# Altium schematic sheet LVDS_CSI.SchDoc
size 420 x 297 mm; Scale: 1:1; DocumentType: Схема электрическая принципиальная; SheetNumber: 19; SheetTotal: 23; DocumentTypeShort: Э3; DocumentInvertoryNumber: ㅤ
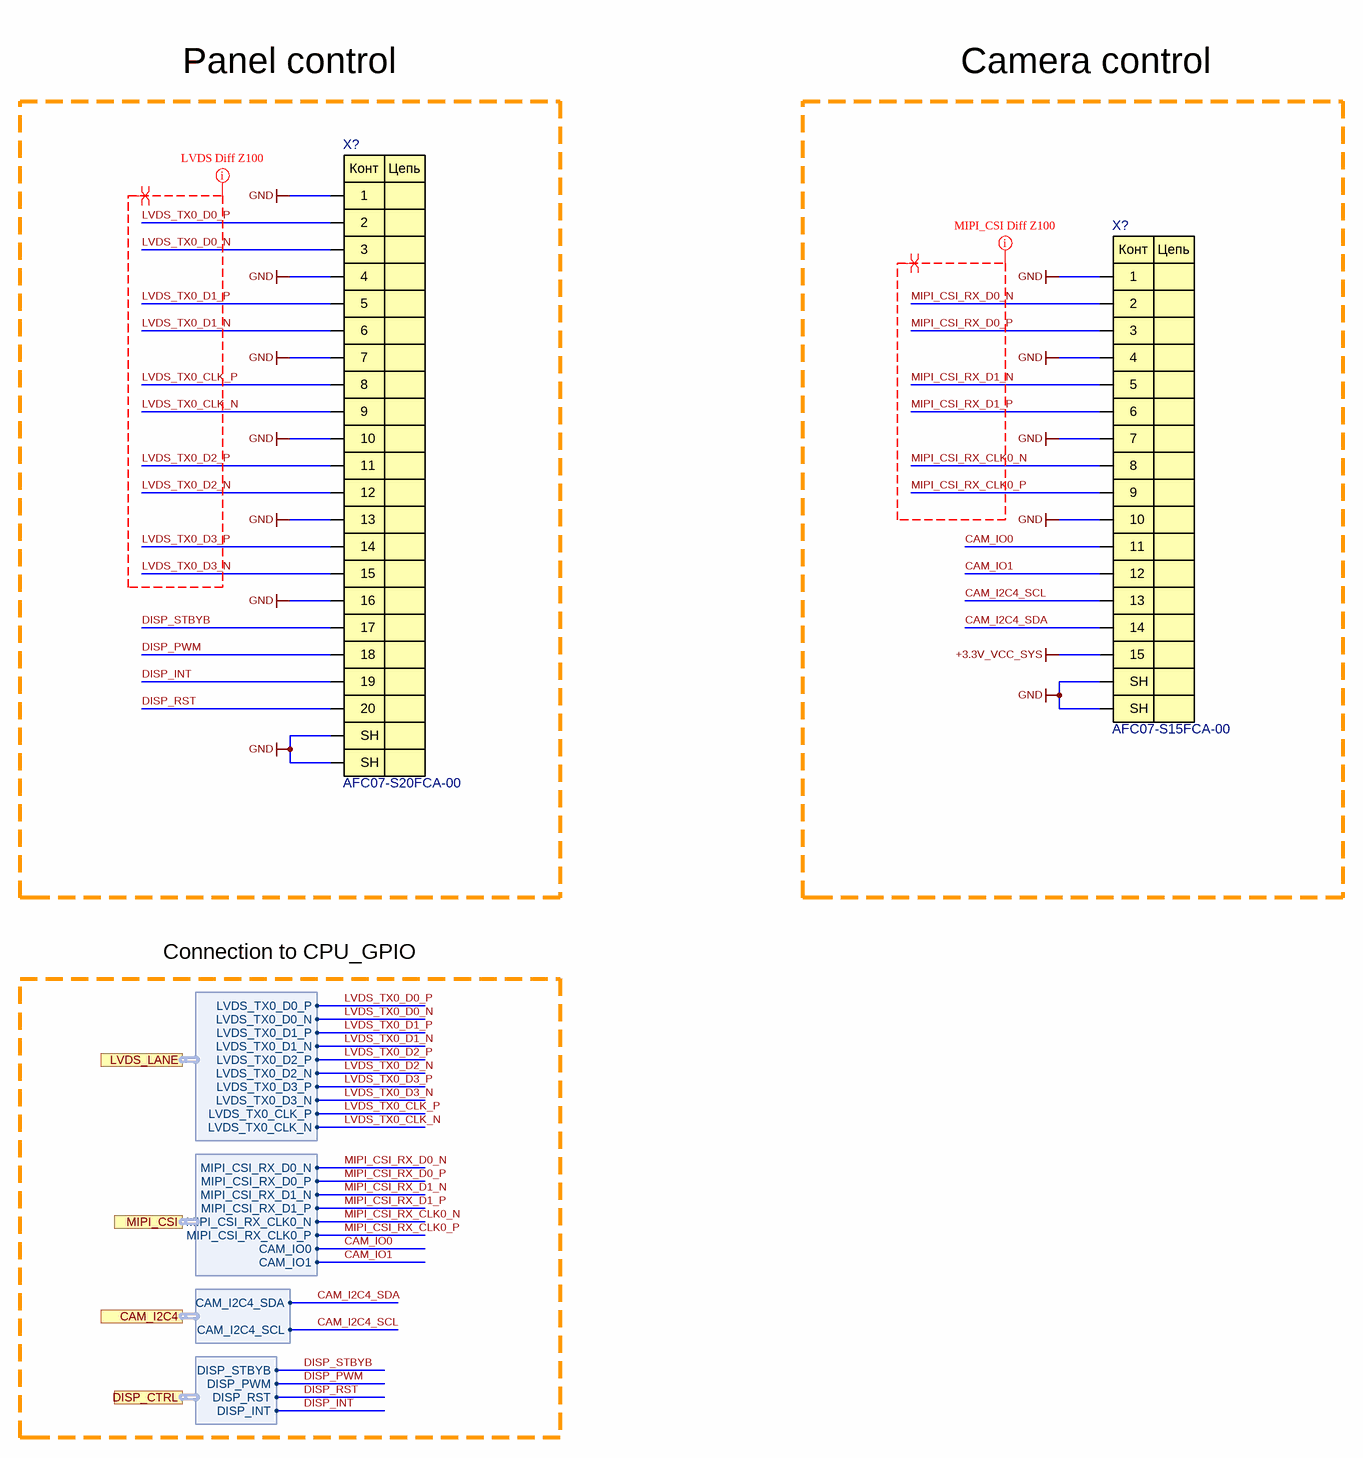
[diagram p0: LVDS_CSI.SchDoc]

## Parts
(Parts that share a designator on the sheet are numbered #1, #2 ... from top to bottom, then left to right.)
X?#1  AFC07-S20FCA-00  [AFC07-S20FCA-00]
X?#2  AFC07-S15FCA-00  [AFC07-S15FCA-00]

## Ports
CAM_I2C4 (harness CAM_I2C4), DISP_CTRL (harness DISP_CTRL), LVDS_LANE (harness LVDS_LANE), MIPI_CSI (harness MIPI_CSI)

## Harnesses
LVDS_LANE: LVDS_TX0_D2_N, LVDS_TX0_D3_N, LVDS_TX0_D3_P, LVDS_TX0_CLK_P, LVDS_TX0_CLK_N, LVDS_TX0_D2_P, LVDS_TX0_D1_N, LVDS_TX0_D1_P, LVDS_TX0_D0_N, LVDS_TX0_D0_P
MIPI_CSI: MIPI_CSI_RX_CLK0_N, MIPI_CSI_RX_CLK0_P, MIPI_CSI_RX_D1_P, MIPI_CSI_RX_D1_N, MIPI_CSI_RX_D0_P, MIPI_CSI_RX_D0_N, CAM_IO0, CAM_IO1
DISP_CTRL: DISP_STBYB, DISP_RST, DISP_PWM, DISP_INT
CAM_I2C4: CAM_I2C4_SCL, CAM_I2C4_SDA

## Nets
+3.3V_VCC_SYS: X?#2.15
GND: X?#1.1 X?#1.4 X?#1.7 X?#1.10 X?#1.13 X?#1.16 X?#1.M1(SH) X?#1.M2(SH) X?#2.1 X?#2.4 X?#2.7 X?#2.10 X?#2.M1(SH) X?#2.M2(SH)
CAM_I2C4_SCL: X?#2.13 ; port CAM_I2C4.CAM_I2C4_SCL
CAM_I2C4_SDA: X?#2.14 ; port CAM_I2C4.CAM_I2C4_SDA
CAM_IO0: X?#2.11 ; port MIPI_CSI.CAM_IO0
CAM_IO1: X?#2.12 ; port MIPI_CSI.CAM_IO1
DISP_INT: X?#1.19 ; port DISP_CTRL.DISP_INT
DISP_PWM: X?#1.18 ; port DISP_CTRL.DISP_PWM
DISP_RST: X?#1.20 ; port DISP_CTRL.DISP_RST
DISP_STBYB: X?#1.17 ; port DISP_CTRL.DISP_STBYB
LVDS_TX0_CLK_N: X?#1.9 ; port LVDS_LANE.LVDS_TX0_CLK_N
LVDS_TX0_CLK_P: X?#1.8 ; port LVDS_LANE.LVDS_TX0_CLK_P
LVDS_TX0_D0_N: X?#1.3 ; port LVDS_LANE.LVDS_TX0_D0_N
LVDS_TX0_D0_P: X?#1.2 ; port LVDS_LANE.LVDS_TX0_D0_P
LVDS_TX0_D1_N: X?#1.6 ; port LVDS_LANE.LVDS_TX0_D1_N
LVDS_TX0_D1_P: X?#1.5 ; port LVDS_LANE.LVDS_TX0_D1_P
LVDS_TX0_D2_N: X?#1.12 ; port LVDS_LANE.LVDS_TX0_D2_N
LVDS_TX0_D2_P: X?#1.11 ; port LVDS_LANE.LVDS_TX0_D2_P
LVDS_TX0_D3_N: X?#1.15 ; port LVDS_LANE.LVDS_TX0_D3_N
LVDS_TX0_D3_P: X?#1.14 ; port LVDS_LANE.LVDS_TX0_D3_P
MIPI_CSI_RX_CLK0_N: X?#2.8 ; port MIPI_CSI.MIPI_CSI_RX_CLK0_N
MIPI_CSI_RX_CLK0_P: X?#2.9 ; port MIPI_CSI.MIPI_CSI_RX_CLK0_P
MIPI_CSI_RX_D0_N: X?#2.2 ; port MIPI_CSI.MIPI_CSI_RX_D0_N
MIPI_CSI_RX_D0_P: X?#2.3 ; port MIPI_CSI.MIPI_CSI_RX_D0_P
MIPI_CSI_RX_D1_N: X?#2.5 ; port MIPI_CSI.MIPI_CSI_RX_D1_N
MIPI_CSI_RX_D1_P: X?#2.6 ; port MIPI_CSI.MIPI_CSI_RX_D1_P

## Layout directives
differential pair: LVDS_TX0_CLK_N, LVDS_TX0_CLK_P, LVDS_TX0_D0_N, LVDS_TX0_D0_P, LVDS_TX0_D1_N, LVDS_TX0_D1_P, LVDS_TX0_D2_N, LVDS_TX0_D2_P, LVDS_TX0_D3_N, LVDS_TX0_D3_P, MIPI_CSI_RX_CLK0_N, MIPI_CSI_RX_CLK0_P, MIPI_CSI_RX_D0_N, MIPI_CSI_RX_D0_P, MIPI_CSI_RX_D1_N, MIPI_CSI_RX_D1_P
net class LVDS: LVDS_TX0_CLK_N, LVDS_TX0_CLK_P, LVDS_TX0_D0_N, LVDS_TX0_D0_P, LVDS_TX0_D1_N, LVDS_TX0_D1_P, LVDS_TX0_D2_N, LVDS_TX0_D2_P, LVDS_TX0_D3_N, LVDS_TX0_D3_P
net class MIPI_CSI: MIPI_CSI_RX_CLK0_N, MIPI_CSI_RX_CLK0_P, MIPI_CSI_RX_D0_N, MIPI_CSI_RX_D0_P, MIPI_CSI_RX_D1_N, MIPI_CSI_RX_D1_P

## Notes on the sheet
- Panel control
- Camera control
- Connection to CPU_GPIO
- Подп. и дата
- Инв. № дубл.
- Взам. инв. №
- Инв. № подл.
- Изм.
- Лист
- № докум.
- Подп.
- Дата
- Копировал
- Формат А3
- (in symbol AFC07-S15FCA-00) Конт; Цепь
- (in symbol AFC07-S20FCA-00) Конт; Цепь

## Library data of the parts
X?#1 = AFC07-S20FCA-00: Slide Lock 20P Bottom Contact Surface Mount，Right Angle 0.5mm SMD,P=0.5mm,Surface Mount，Right Angle FFC/FPC Connectors; Manufacturer: JUSHUO; Check: False; Part Number: AFC07-S20FCA-00; Value: AFC07-S20FCA-00; NameFromManufacturer: AFC07-S20FCA-00
X?#2 = AFC07-S15FCA-00: lide Lock 15P Bottom Contact Surface Mount，Right Angle 0.5mm SMD,P=0.5mm,Surface Mount，Right Angle FFC/FPC Connectors; Manufacturer: JUSHUO; Check: False; Part Number: AFC07-S15FCA-00; Value: AFC07-S15FCA-00; NameFromManufacturer: AFC07-S15FCA-00